# Altium schematic sheet SAMARUC.SchDoc
size A4; SheetNumber: 1; SheetTotal: 9
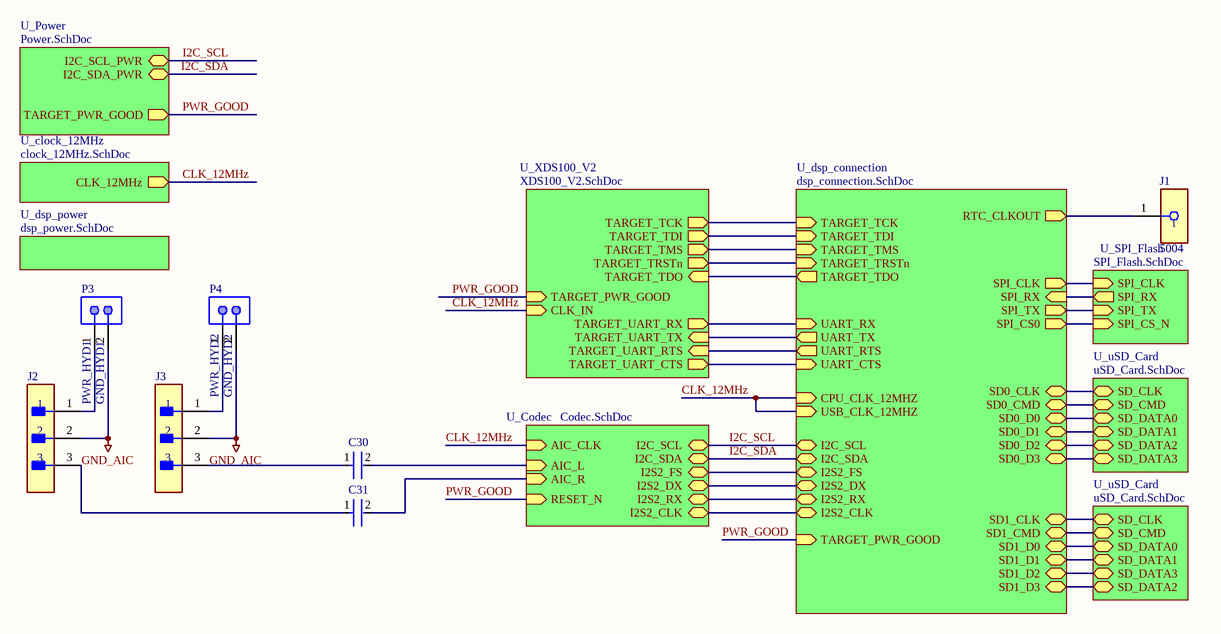
[diagram p0: SAMARUC.SchDoc]

## Parts
C30  RCER71H106MWK1H03B  [FP-RCEWM1-MFG]  (value not drawn)
C31  RCER71H106MWK1H03B  [FP-RCEWM1-MFG]  (value not drawn)
J1  5004  [FP-5004-MFG]
J2  22-11-2032  [FP-22-11-2032-MFG]  (value not drawn)
J3  22-11-2032  [FP-22-11-2032-MFG]  (value not drawn)
P3  22-23-2021  [MOLX-22-23-2021_V]  (value not drawn)
P4  22-23-2021  [MOLX-22-23-2021_V]  (value not drawn)

## Sub-sheets
U_clock_12MHz = clock_12MHz.SchDoc: CLK_12MHz (out)
U_Codec = Codec.SchDoc: I2C_SCL (bidir), I2C_SDA (bidir), I2S2_FS (bidir), I2S2_DX (bidir), I2S2_RX (bidir), I2S2_CLK (bidir), RESET_N (in), AIC_L (in), AIC_R (in), AIC_CLK (in)
U_dsp_connection = dsp_connection.SchDoc: TARGET_TCK (in), TARGET_TDI (in), TARGET_TDO (out), TARGET_TMS (in), TARGET_TRSTn (in), I2C_SCL (bidir), I2C_SDA (bidir), I2S2_FS (bidir), I2S2_DX (bidir), I2S2_RX (bidir), I2S2_CLK (bidir), USB_CLK_12MHZ (in), RTC_CLKOUT (out), CPU_CLK_12MHZ (in), SD0_D0 (bidir), SD1_D1 (bidir), UART_RX (in), UART_TX (out), SD0_D1 (bidir), UART_RTS (out), SD1_CMD (bidir), SD0_D3 (bidir), SD0_CMD (bidir), SPI_CLK (out), SD1_CLK (bidir), SD1_D0 (bidir), UART_CTS (in), SPI_TX (out), SD0_D2 (bidir), SPI_RX (in), SD1_D2 (bidir), SPI_CS0 (out), SD0_CLK (bidir), SD1_D3 (bidir), TARGET_PWR_GOOD (in)
U_dsp_power = dsp_power.SchDoc: no entries
U_Power = Power.SchDoc: TARGET_PWR_GOOD (out), I2C_SCL_PWR (bidir), I2C_SDA_PWR (bidir)
U_SPI_Flash = SPI_Flash.SchDoc: SPI_CLK (in), SPI_TX (in), SPI_CS_N (in), SPI_RX (out)
U_uSD_Card = uSD_Card.SchDoc: SD_DATA2 (bidir), SD_DATA3 (bidir), SD_CMD (bidir), SD_CLK (bidir), SD_DATA0 (bidir), SD_DATA1 (bidir)
U_uSD_Card = uSD_Card.SchDoc: SD_DATA2 (bidir), SD_DATA3 (bidir), SD_CMD (bidir), SD_CLK (bidir), SD_DATA0 (bidir), SD_DATA1 (bidir)
U_XDS100_V2 = XDS100_V2.SchDoc: CLK_IN (in), TARGET_TCK (out), TARGET_TDI (out), TARGET_TDO (in), TARGET_TMS (out), TARGET_TRSTn (out), TARGET_PWR_GOOD (in), TARGET_UART_TX (in), TARGET_UART_RX (out), TARGET_UART_CTS (out), TARGET_UART_RTS (in)

## Nets
GND_AIC: J2.2 J3.2 P3.2 P4.2
CLK_12MHz: sheet U_Codec/AIC_CLK, sheet U_clock_12MHz/CLK_12MHz, sheet U_dsp_connection/USB_CLK_12MHZ, sheet U_dsp_connection/CPU_CLK_12MHZ, sheet U_XDS100_V2/CLK_IN
I2C_SCL: sheet U_Codec/I2C_SCL, sheet U_dsp_connection/I2C_SCL, sheet U_Power/I2C_SCL_PWR
I2C_SDA: sheet U_Codec/I2C_SDA, sheet U_dsp_connection/I2C_SDA, sheet U_Power/I2C_SDA_PWR
PWR_GOOD: sheet U_Codec/RESET_N, sheet U_dsp_connection/TARGET_PWR_GOOD, sheet U_XDS100_V2/TARGET_PWR_GOOD, sheet U_Power/TARGET_PWR_GOOD
NetC30_1: C30.1 J3.3
NetC30_2: C30.2 ; sheet U_Codec/AIC_L
NetC31_1: C31.1 J2.3
NetC31_2: C31.2 ; sheet U_Codec/AIC_R
NetJ1_1: J1.1 ; sheet U_dsp_connection/RTC_CLKOUT
NetJ2_1: J2.1 P3.1
NetJ3_1: J3.1 P4.1
(unnamed): sheet U_Codec/I2S2_FS, sheet U_dsp_connection/I2S2_FS
(unnamed): sheet U_Codec/I2S2_DX, sheet U_dsp_connection/I2S2_DX
(unnamed): sheet U_Codec/I2S2_RX, sheet U_dsp_connection/I2S2_RX
(unnamed): sheet U_Codec/I2S2_CLK, sheet U_dsp_connection/I2S2_CLK
(unnamed): sheet U_SPI_Flash/SPI_CLK, sheet U_dsp_connection/SPI_CLK
(unnamed): sheet U_SPI_Flash/SPI_TX, sheet U_dsp_connection/SPI_TX
(unnamed): sheet U_SPI_Flash/SPI_CS_N, sheet U_dsp_connection/SPI_CS0
(unnamed): sheet U_SPI_Flash/SPI_RX, sheet U_dsp_connection/SPI_RX
(unnamed): sheet U_uSD_Card/SD_DATA2, sheet U_dsp_connection/SD1_D3
(unnamed): sheet U_uSD_Card/SD_DATA3, sheet U_dsp_connection/SD1_D2
(unnamed): sheet U_uSD_Card/SD_CMD, sheet U_dsp_connection/SD1_CMD
(unnamed): sheet U_uSD_Card/SD_CLK, sheet U_dsp_connection/SD1_CLK
(unnamed): sheet U_uSD_Card/SD_DATA0, sheet U_dsp_connection/SD1_D0
(unnamed): sheet U_uSD_Card/SD_DATA1, sheet U_dsp_connection/SD1_D1
(unnamed): sheet U_dsp_connection/TARGET_TCK, sheet U_XDS100_V2/TARGET_TCK
(unnamed): sheet U_dsp_connection/TARGET_TDI, sheet U_XDS100_V2/TARGET_TDI
(unnamed): sheet U_dsp_connection/TARGET_TDO, sheet U_XDS100_V2/TARGET_TDO
(unnamed): sheet U_dsp_connection/TARGET_TMS, sheet U_XDS100_V2/TARGET_TMS
(unnamed): sheet U_dsp_connection/TARGET_TRSTn, sheet U_XDS100_V2/TARGET_TRSTn
(unnamed): sheet U_dsp_connection/SD0_D0, sheet U_uSD_Card/SD_DATA0
(unnamed): sheet U_dsp_connection/UART_RX, sheet U_XDS100_V2/TARGET_UART_RX
(unnamed): sheet U_dsp_connection/UART_TX, sheet U_XDS100_V2/TARGET_UART_TX
(unnamed): sheet U_dsp_connection/SD0_D1, sheet U_uSD_Card/SD_DATA1
(unnamed): sheet U_dsp_connection/UART_RTS, sheet U_XDS100_V2/TARGET_UART_RTS
(unnamed): sheet U_dsp_connection/SD0_D3, sheet U_uSD_Card/SD_DATA3
(unnamed): sheet U_dsp_connection/SD0_CMD, sheet U_uSD_Card/SD_CMD
(unnamed): sheet U_dsp_connection/UART_CTS, sheet U_XDS100_V2/TARGET_UART_CTS
(unnamed): sheet U_dsp_connection/SD0_D2, sheet U_uSD_Card/SD_DATA2
(unnamed): sheet U_dsp_connection/SD0_CLK, sheet U_uSD_Card/SD_CLK

## Notes on the sheet
- PWR_HYD1
- GND_HYD1
- PWR_HYD2
- (near P4) GND_HYD2

## Library data of the parts
C30 C31 = CMP-06035-035073-1: Cap Ceramic 10uF 50V X7R ±20% Radial 5mm +125°C Automotive Ammo Pack; Lead/Base Style: Formed Leads; Lead Diameter: 0.5mm; Width: 4mm; Max Operating Temperature: 125°C; Case/Package: Radial; Capacitance: 10uF; Mount: Through Hole; Depth: 7.5mm; Dielectric: X7R; Tolerance: 20%; Length: 5.5mm; Min Operating Temperature: -55°C; Height: 7.5mm; Ratings: AEC-Q200; Voltage Rating: 50V; Lead Pitch: 0.197inch; Diameter: 5.5mm; Height - Seated (Max): 0.295inch; Voltage: 50V; Resistor Type: Ceramic; Voltage Rating (DC): 50V; Package Quantity: 500; Lead Free: Lead Free; Packaging: Bulk; Termination: Radial
J1 = CMP-2000-05575-2: PC TEST POINT MINIATURE YELLOW; Manufacturer: Keystone; Number Of Contacts: 1; Is Female: yes; Device Class L1: Connectors; Manufacturer Part Number: 5004; Digikey Description: PC TEST POINT MINIATURE YELLOW; ComponentLink2URL: https://www.keyelco.com/product-pdf.cfm?p=1313; Lead Free: Yes; ComponentLink2Description: Datasheet; Category: Conn; Height: 4.72mm; Octopart: https://octopart.com/5004-keystone-28591; Mouser Description: TEST POINT PC MINI .040"D YELLOW; Device Class L3: unset; Contact Material: Silver; Package: 5004; Automotive: No; Device Class L2: unset; RoHS: TRUE
J2 J3 = CMP-04776-000113-1: CONN HEADER VERT 3POS 2.54MM; Manufacturer: Molex; Number Of Contacts: 3; Voltage Rating: 500V; Conn Gender: Male; Current Rating: 4A; Conn Orientation: Vertical; Device Class L2: Headers and Wire Housings; Number Of Rows: 1; Temperature Range High: +80°C; RoHS: TRUE; ComponentLink2URL: https://www.molex.com/webdocs/datasheets/pdf/en-us/0022112032_PCB_HEADERS.pdf; Manufacturer Part Number: 22-11-2032; Device Class L3: unset; Automotive: No; Temperature: -40°C to +80°C; Temperature Range Low: -40°C; Lead Free: Yes; Pitch: 2.54mm; Footprint Url: https://www.molex.com/pdm_docs/sd/022112032_sd.pdf; Digikey Description: CONN HEADER VERT 3POS 2.54MM; Contact Material: Gold,Nickel; Octopart: https://octopart.com/22-11-2032-molex-10085; Height: 10.91mm; Mouser Description: KK® 254 Solid Header, Vertical, with Friction Lock, 3 Circuits, Gold (Au) Plating; Package: 22-11-2032; Device Class L1: Connectors; Mounting Type: Through Hole; ComponentLink2Description: Datasheet; Category: Conn
P3 P4 = CMP-1704-00001-3: Male Header, Pitch 2.54 mm, 1 x 2 Position, Height 10.67 mm, Tail Length 3.56 mm, 0 to 75 degC, RoHS, Bulk; Package Quantity: 3000; Height: 10.67 mm; RoHSCompliant: True; ComponentLink2URL: https://datasheet.ciiva.com/19454/232266-19454304.pdf; PartNumber: 22-23-2021; Packaging: Bulk; ComponentLink2Description: Datasheet; Min Operating Temperature: 0 degC; ComponentLink1Description: Manufacturer URL; Length: 5.08 mm; Mounting Technology: Through Hole; Max Operating Temperature: 75 degC; REACH SVHC: Unknown; PackageDescription: Male Header, Pitch 2.54 mm, 1 x 2 Position, Height 10.67 mm, Tail Length 3.56 mm; ComponentLink1URL: http://www.molex.com/; Mount: Through Hole; Radiation Hardening: No; Width: 6.35 mm; Pins: 2